# Altium schematic sheet DigitalInput.SchDoc: Digital input
size A3; Author: eldar6776@hotmail.com; DrawnBy: Eldar Dediæ; Organization: PROVEN d.o.o.; Address1: Adema Buæe 102; Address2: 71000 Sarajevo; Address3: Federacija BiH; Address4: Bosna i Hercegovina; DocumentNumber: DE211213; Revision: 001; SheetNumber: 3; SheetTotal: 15; ProjectName: MIKSER SIROVINE
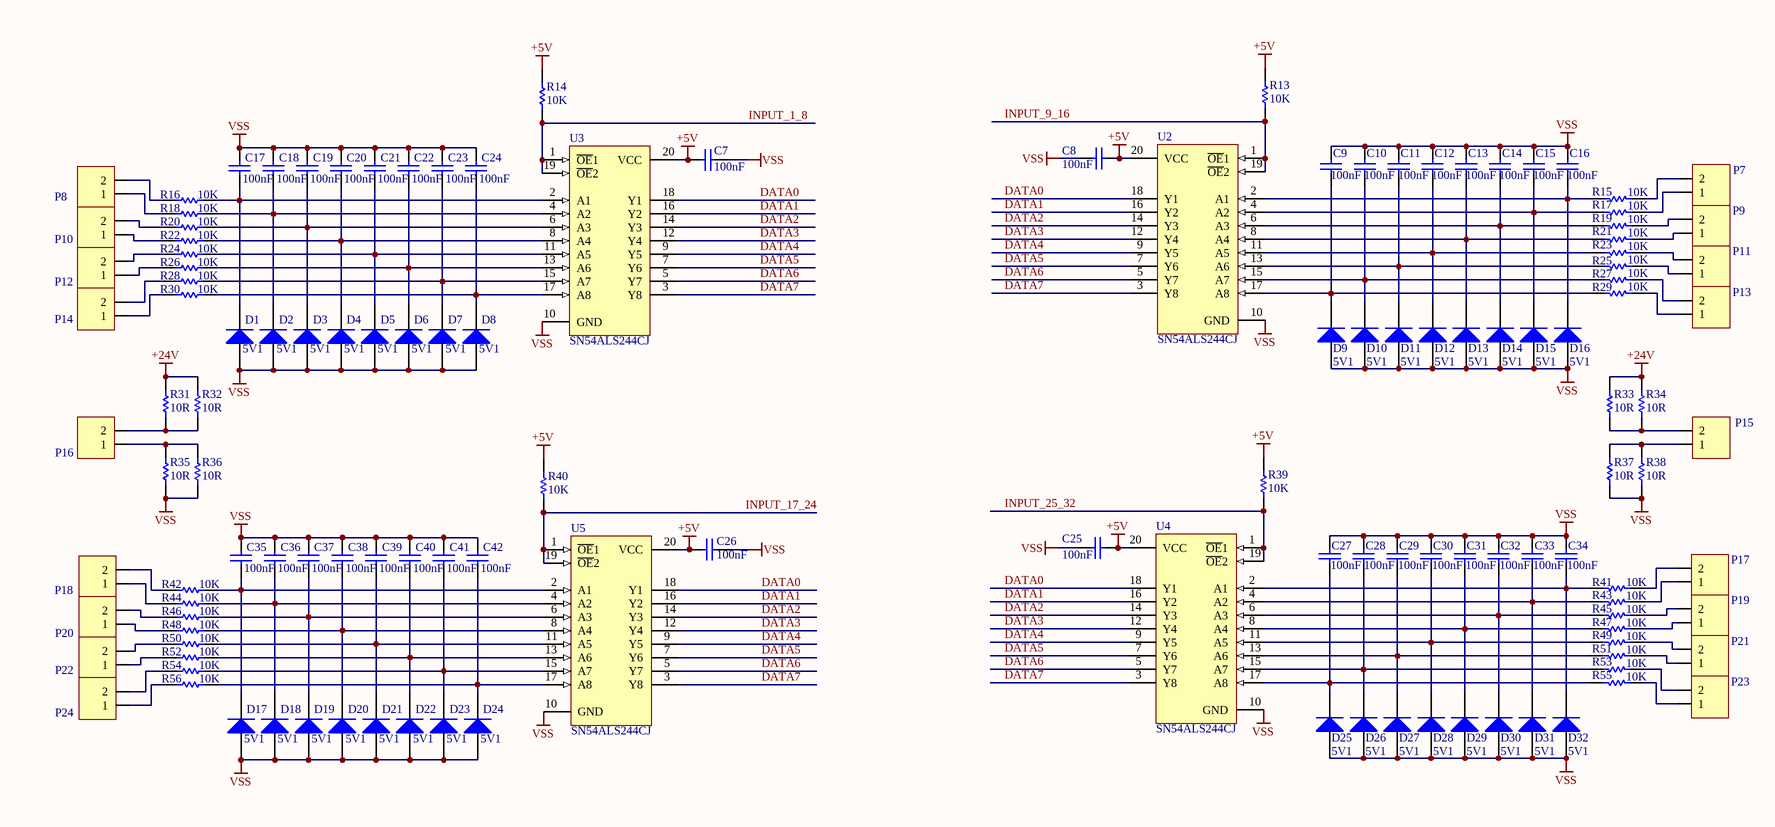
[diagram p0: DigitalInput.SchDoc]

## Parts
C7  value 100nF  [1206]
C8  value 100nF  [1206]
C9  value 100nF  [1206]
C10  value 100nF  [1206]
C11  value 100nF  [1206]
C12  value 100nF  [1206]
C13  value 100nF  [1206]
C14  value 100nF  [1206]
C15  value 100nF  [1206]
C16  value 100nF  [1206]
C17  value 100nF  [1206]
C18  value 100nF  [1206]
C19  value 100nF  [1206]
C20  value 100nF  [1206]
C21  value 100nF  [1206]
C22  value 100nF  [1206]
C23  value 100nF  [1206]
C24  value 100nF  [1206]
C25  value 100nF  [1206]
C26  value 100nF  [1206]
C27  value 100nF  [1206]
C28  value 100nF  [1206]
C29  value 100nF  [1206]
C30  value 100nF  [1206]
C31  value 100nF  [1206]
C32  value 100nF  [1206]
C33  value 100nF  [1206]
C34  value 100nF  [1206]
C35  value 100nF  [1206]
C36  value 100nF  [1206]
C37  value 100nF  [1206]
C38  value 100nF  [1206]
C39  value 100nF  [1206]
C40  value 100nF  [1206]
C41  value 100nF  [1206]
C42  value 100nF  [1206]
D1  5V1  [SOD80C]
D2  5V1  [SOD80C]
D3  5V1  [SOD80C]
D4  5V1  [SOD80C]
D5  5V1  [SOD80C]
D6  5V1  [SOD80C]
D7  5V1  [SOD80C]
D8  5V1  [SOD80C]
D9  5V1  [SOD80C]
D10  5V1  [SOD80C]
D11  5V1  [SOD80C]
D12  5V1  [SOD80C]
D13  5V1  [SOD80C]
D14  5V1  [SOD80C]
D15  5V1  [SOD80C]
D16  5V1  [SOD80C]
D17  5V1  [SOD80C]
D18  5V1  [SOD80C]
D19  5V1  [SOD80C]
D20  5V1  [SOD80C]
D21  5V1  [SOD80C]
D22  5V1  [SOD80C]
D23  5V1  [SOD80C]
D24  5V1  [SOD80C]
D25  5V1  [SOD80C]
D26  5V1  [SOD80C]
D27  5V1  [SOD80C]
D28  5V1  [SOD80C]
D29  5V1  [SOD80C]
D30  5V1  [SOD80C]
D31  5V1  [SOD80C]
D32  5V1  [SOD80C]
P7  (no value)  [TERMINAL BLOK 2]
P8  (no value)  [TERMINAL BLOK 2]
P9  (no value)  [TERMINAL BLOK 2]
P10  (no value)  [TERMINAL BLOK 2]
P11  (no value)  [TERMINAL BLOK 2]
P12  (no value)  [TERMINAL BLOK 2]
P13  (no value)  [TERMINAL BLOK 2]
P14  (no value)  [TERMINAL BLOK 2]
P15  (no value)  [TERMINAL BLOK 2]
P16  (no value)  [TERMINAL BLOK 2]
P17  (no value)  [TERMINAL BLOK 2]
P18  (no value)  [TERMINAL BLOK 2]
P19  (no value)  [TERMINAL BLOK 2]
P20  (no value)  [TERMINAL BLOK 2]
P21  (no value)  [TERMINAL BLOK 2]
P22  (no value)  [TERMINAL BLOK 2]
P23  (no value)  [TERMINAL BLOK 2]
P24  (no value)  [TERMINAL BLOK 2]
R13  10K  [ERA-0805]
R14  10K  [ERA-0805]
R15  10K  [ERA-0805]
R16  10K  [ERA-0805]
R17  10K  [ERA-0805]
R18  10K  [ERA-0805]
R19  10K  [ERA-0805]
R20  10K  [ERA-0805]
R21  10K  [ERA-0805]
R22  10K  [ERA-0805]
R23  10K  [ERA-0805]
R24  10K  [ERA-0805]
R25  10K  [ERA-0805]
R26  10K  [ERA-0805]
R27  10K  [ERA-0805]
R28  10K  [ERA-0805]
R29  10K  [ERA-0805]
R30  10K  [ERA-0805]
R31  10R  [ERA-0603]
R32  10R  [ERA-0603]
R33  10R  [ERA-0603]
R34  10R  [ERA-0603]
R35  10R  [ERA-0603]
R36  10R  [ERA-0603]
R37  10R  [ERA-0603]
R38  10R  [ERA-0603]
R39  10K  [ERA-0805]
R40  10K  [ERA-0805]
R41  10K  [ERA-0805]
R42  10K  [ERA-0805]
R43  10K  [ERA-0805]
R44  10K  [ERA-0805]
R45  10K  [ERA-0805]
R46  10K  [ERA-0805]
R47  10K  [ERA-0805]
R48  10K  [ERA-0805]
R49  10K  [ERA-0805]
R50  10K  [ERA-0805]
R51  10K  [ERA-0805]
R52  10K  [ERA-0805]
R53  10K  [ERA-0805]
R54  10K  [ERA-0805]
R55  10K  [ERA-0805]
R56  10K  [ERA-0805]
U2  SN54ALS244CJ  [J020]
U3  SN54ALS244CJ  [J020]
U4  SN54ALS244CJ  [J020]
U5  SN54ALS244CJ  [J020]

## Nets
+5V: C7.1 C8.1 C25.1 C26.1 R13.2 R14.2 R39.2 R40.2 U2.20(VCC) U3.20(VCC) U4.20(VCC) U5.20(VCC)
+24V: R31.2 R32.2 R33.2 R34.2
VSS: C7.2 C8.2 C9.2 C10.2 C11.2 C12.2 C13.2 C14.2 C15.2 C16.2 C17.2 C18.2 C19.2 C20.2 C21.2 C22.2 C23.2 C24.2 C25.2 C26.2 C27.2 C28.2 C29.2 C30.2 C31.2 C32.2 C33.2 C34.2 C35.2 C36.2 C37.2 C38.2 C39.2 C40.2 C41.2 C42.2 D1.1(A) D2.1(A) D3.1(A) D4.1(A) D5.1(A) D6.1(A) D7.1(A) D8.1(A) D9.1(A) D10.1(A) D11.1(A) D12.1(A) D13.1(A) D14.1(A) D15.1(A) D16.1(A) D17.1(A) D18.1(A) D19.1(A) D20.1(A) D21.1(A) D22.1(A) D23.1(A) D24.1(A) D25.1(A) D26.1(A) D27.1(A) D28.1(A) D29.1(A) D30.1(A) D31.1(A) D32.1(A) R35.1 R36.1 R37.1 R38.1 U2.10(GND) U3.10(GND) U4.10(GND) U5.10(GND)
DATA0: U2.18(Y1) U3.18(Y1) U4.18(Y1) U5.18(Y1)
DATA1: U2.16(Y2) U3.16(Y2) U4.16(Y2) U5.16(Y2)
DATA2: U2.14(Y3) U3.14(Y3) U4.14(Y3) U5.14(Y3)
DATA3: U2.12(Y4) U3.12(Y4) U4.12(Y4) U5.12(Y4)
DATA4: U2.9(Y5) U3.9(Y5) U4.9(Y5) U5.9(Y5)
DATA5: U2.7(Y6) U3.7(Y6) U4.7(Y6) U5.7(Y6)
DATA6: U2.5(Y7) U3.5(Y7) U4.5(Y7) U5.5(Y7)
DATA7: U2.3(Y8) U3.3(Y8) U4.3(Y8) U5.3(Y8)
INPUT_1_8: R14.1 U3.1(~{OE}1) U3.19(~{OE}2)
INPUT_9_16: R13.1 U2.1(~{OE}1) U2.19(~{OE}2)
INPUT_17_24: R40.1 U5.1(~{OE}1) U5.19(~{OE}2)
INPUT_25_32: R39.1 U4.1(~{OE}1) U4.19(~{OE}2)
NetC9_1: C9.1 D9.2(K) R29.2 U2.17(A8)
NetC10_1: C10.1 D10.2(K) R27.2 U2.15(A7)
NetC11_1: C11.1 D11.2(K) R25.2 U2.13(A6)
NetC12_1: C12.1 D12.2(K) R23.2 U2.11(A5)
NetC13_1: C13.1 D13.2(K) R21.2 U2.8(A4)
NetC14_1: C14.1 D14.2(K) R19.2 U2.6(A3)
NetC15_1: C15.1 D15.2(K) R17.2 U2.4(A2)
NetC16_1: C16.1 D16.2(K) R15.2 U2.2(A1)
NetC17_1: C17.1 D1.2(K) R16.2 U3.2(A1)
NetC18_1: C18.1 D2.2(K) R18.2 U3.4(A2)
NetC19_1: C19.1 D3.2(K) R20.2 U3.6(A3)
NetC20_1: C20.1 D4.2(K) R22.2 U3.8(A4)
NetC21_1: C21.1 D5.2(K) R24.2 U3.11(A5)
NetC22_1: C22.1 D6.2(K) R26.2 U3.13(A6)
NetC23_1: C23.1 D7.2(K) R28.2 U3.15(A7)
NetC24_1: C24.1 D8.2(K) R30.2 U3.17(A8)
NetC27_1: C27.1 D25.2(K) R55.2 U4.17(A8)
NetC28_1: C28.1 D26.2(K) R53.2 U4.15(A7)
NetC29_1: C29.1 D27.2(K) R51.2 U4.13(A6)
NetC30_1: C30.1 D28.2(K) R49.2 U4.11(A5)
NetC31_1: C31.1 D29.2(K) R47.2 U4.8(A4)
NetC32_1: C32.1 D30.2(K) R45.2 U4.6(A3)
NetC33_1: C33.1 D31.2(K) R43.2 U4.4(A2)
NetC34_1: C34.1 D32.2(K) R41.2 U4.2(A1)
NetC35_1: C35.1 D17.2(K) R42.2 U5.2(A1)
NetC36_1: C36.1 D18.2(K) R44.2 U5.4(A2)
NetC37_1: C37.1 D19.2(K) R46.2 U5.6(A3)
NetC38_1: C38.1 D20.2(K) R48.2 U5.8(A4)
NetC39_1: C39.1 D21.2(K) R50.2 U5.11(A5)
NetC40_1: C40.1 D22.2(K) R52.2 U5.13(A6)
NetC41_1: C41.1 D23.2(K) R54.2 U5.15(A7)
NetC42_1: C42.1 D24.2(K) R56.2 U5.17(A8)
NetP7_1: P7.1 R17.1
NetP7_2: P7.2 R15.1
NetP8_1: P8.1 R18.1
NetP8_2: P8.2 R16.1
NetP9_1: P9.1 R21.1
NetP9_2: P9.2 R19.1
NetP10_1: P10.1 R22.1
NetP10_2: P10.2 R20.1
NetP11_1: P11.1 R25.1
NetP11_2: P11.2 R23.1
NetP12_1: P12.1 R26.1
NetP12_2: P12.2 R24.1
NetP13_1: P13.1 R29.1
NetP13_2: P13.2 R27.1
NetP14_1: P14.1 R30.1
NetP14_2: P14.2 R28.1
NetP15_1: P15.1 R37.2 R38.2
NetP15_2: P15.2 R33.1 R34.1
NetP16_1: P16.1 R35.2 R36.2
NetP16_2: P16.2 R31.1 R32.1
NetP17_1: P17.1 R43.1
NetP17_2: P17.2 R41.1
NetP18_1: P18.1 R44.1
NetP18_2: P18.2 R42.1
NetP19_1: P19.1 R47.1
NetP19_2: P19.2 R45.1
NetP20_1: P20.1 R48.1
NetP20_2: P20.2 R46.1
NetP21_1: P21.1 R51.1
NetP21_2: P21.2 R49.1
NetP22_1: P22.1 R52.1
NetP22_2: P22.2 R50.1
NetP23_1: P23.1 R55.1
NetP23_2: P23.2 R53.1
NetP24_1: P24.1 R56.1
NetP24_2: P24.2 R54.1

## Notes on the sheet
- Title
- Size:
- Date:
- A3
- Number:
- Time:
- Revision:
- Sheet
- of
- File:

## Library data of the parts
C7-C42 = C1206: Ceramic Chip Capacitor - Standard; Published: 17-Jul-2002; LatestRevisionDate: 19-Mar-2004; LatestRevisionNote: Silkscreen size reduced.; DatasheetDocument: Mar-2001; PackageDocument: Mar-2001; PackageReference: 1206; Publisher: Altium Limited; Code_JEITA: 1206; Code_IPC: 3216 [1206]; ComponentLink1Description: Manufacturer Link; ComponentLink1URL: http://www.kemet.com/; ComponentLink2Description: Datasheet; ComponentLink2URL: http://www.kemet.com/kemet/web/homepage/kechome.nsf/vapubfilesname/F3102TA.pdf/$file/F3102TA.pdf
D1-D32 = BZV85-C5V1: Voltage Regulator Diode; Published: 17-Sep-2003; DatasheetVersion: 11-May-1999; PackageVersion: May-1999; PackageReference: SOD66; Publisher: Altium Limited; PackageDescription: Diode, Axial; Body 4.8 x 2.6 mm (LxDia. max), Lead Dia. 0.81 mm (max); Code_JEDEC: DO-204-AL; ComponentLink1Description: Manufacturer Link; ComponentLink1URL: http://www.semiconductors.philips.com/; ComponentLink2Description: Datasheet; ComponentLink2URL: http://www.semiconductors.philips.com/acrobat/datasheets/BZV85_2.pdf
P7-P24 = Terminal blok 2 pina: Terminal blok 2
R13-R30 R39-R56 = ERA6Y: Rectangular Thick Film Chip Resistor, 10 Ohm to 1M Ohm Range, 0.1% and 0.5% Tolerance, 0805 Size, 0.1 W; Note: If flow soldering, adjust pad width of PCB Footprint to 0.7 - 0.8 times the width of the resistor.; Published: 17-Dec-2003; LatestRevisionDate: 19-Mar-2004; LatestRevisionNote: Silkscreen size reduced.; PackageDocument: Mar-2003; PackageReference: ERA-0805; Publisher: Altium Limited; Code_IPC: 2012 [0805]; ComponentLink1Description: Manufacturer Link; ComponentLink1URL: http://www.panasonic.com/industrial/components/resistive_products.htm; ComponentLink2Description: Datasheet; ComponentLink2URL: http://www.panasonic.com/industrial/components/pdf/AOA0000CE8.pdf
R31-R38 = ERA3Y: Rectangular Thick Film Chip Resistor, 10 Ohm to 330k Ohm Range, 0.1% and 0.5% Tolerance, 0603 Size, 0.063 W; Note: If flow soldering, adjust pad width of PCB Footprint to 0.7 - 0.8 times the width of the resistor.; Published: 17-Dec-2003; LatestRevisionDate: 19-Mar-2004; LatestRevisionNote: Silkscreen size reduced.; PackageDocument: Mar-2003; PackageReference: ERA-0603; Publisher: Altium Limited; Code_IPC: 1608 [0603]; ComponentLink1Description: Manufacturer Link; ComponentLink1URL: http://www.panasonic.com/industrial/components/resistive_products.htm; ComponentLink2Description: Datasheet; ComponentLink2URL: http://www.panasonic.com/industrial/components/pdf/AOA0000CE8.pdf
U2-U5 = SN54ALS244CJ: Octal Buffer/Driver with 3-State Outputs; Published: 8-Jun-2000; LatestRevisionDate: 06-Jun-2005; LatestRevisionNote: Stylized 3D Model Added.; DatasheetVersion: Aug-1995; PackageVersion: Jun-1999; PackageReference: J020; Publisher: Altium Limited; PackageDescription: DIP; 20 Leads; Row Spacing 7.62 mm; Pitch 2.54 mm; ComponentLink1Description: Manufacturer Link; ComponentLink1URL: http://www.ti.com/; ComponentLink2Description: Datasheet; ComponentLink2URL: http://www-s.ti.com/sc/ds/sn74als244c.pdf